# Altium schematic sheet supply_kbd_lcd.SchDoc
size A4
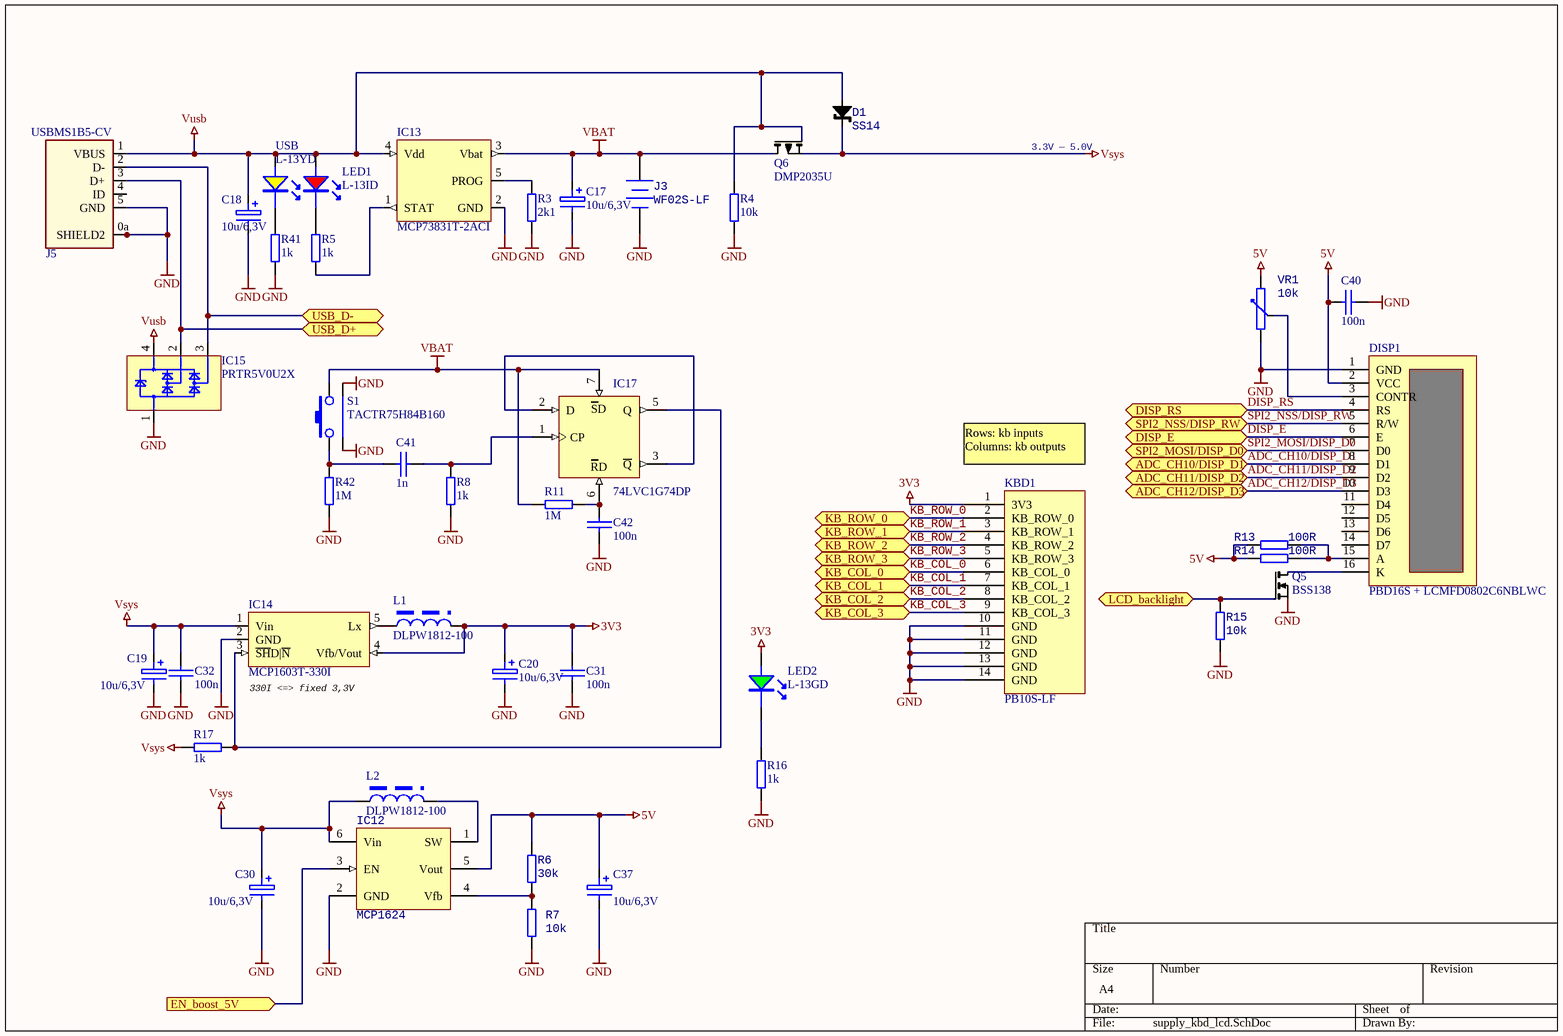
[diagram p0: supply_kbd_lcd.SchDoc]

## Parts
C17  10u/6,3V  [1411_SMDB]
C18  10u/6,3V  [1411_SMDB]
C19  10u/6,3V  [1411_SMDB]
C20  10u/6,3V  [1411_SMDB]
C30  10u/6,3V  [1411_SMDB]
C31  100n  [0603C]
C32  100n  [0603C]
C37  10u/6,3V  [1411_SMDB]
C40  100n  [0603C]
C41  1n  [0603C]
C42  100n  [0603C]
D1  SS14  [DO-214AC/SMA]
DISP1  PBD16S + LCMFD0802C6NBLWC  [IDC16]
IC12  MCP1624  [SOT23-6]
IC13  MCP73831T-2ACI  [SOT23-5]
IC14  MCP1603T-330I  [SOT23-5]
IC15  PRTR5V0U2X  [sot143b]
IC17  74LVC1G74DP  [SOP65P400X110-8N]
J3  WF02S-LF  [CON_WF02S-LF]
J5  USBMS1B5-CV  [USBMS1B5-CV]
KBD1  PB10S-LF  [KBD]
L1  DLPW1812-100  [PW4532]
L2  DLPW1812-100  [PW4532]
LED1  L-13ID  [LED_L-13ID]
LED2  L-13GD  [LED_L-13GD]
Q5  BSS138  [SOT-23]
Q6  DMP2035U  [sot-23]
R3  2k1  [0603R]
R4  10k  [0603R]
R5  1k  [0603R]
R6  30k  [0603R]
R7  10k  [0603R]
R8  1k  [0603R]
R11  1M  [0603R]
R13  100R  [0603R]
R14  100R  [0603R]
R15  10k  [0603R]
R16  1k  [0603R]
R17  1k  [0603R]
R41  1k  [0603R]
R42  1M  [0603R]
S1  TACTR75H84B160  [PB_ALPS_SKHHLQA010]
USB  L-13YD  [LED_L-13YD]
VR1  10k  [POT_RM6v]

## Ports
ADC_CH10/DISP_D1, ADC_CH11/DISP_D2, ADC_CH12/DISP_D3, DISP_E, DISP_RS, EN_boost_5V (in), KB_COL_0, KB_COL_1, KB_COL_2, KB_COL_3, KB_ROW_0, KB_ROW_1, KB_ROW_2, KB_ROW_3, LCD_backlight, SPI2_MOSI/DISP_D0, SPI2_NSS/DISP_RW, USB_D+, USB_D-

## Nets
3V3: C20.1 C31.1 IC14.4(Vfb/Vout) KBD1.1(3V3) L1.2 LED2.A
5V: C37.1 C40.1 DISP1.2(VCC) IC12.5(Vout) R6.2 R13.2 R14.2 VR1.3(U)
GND: C17.2 C18.2 C19.2 C20.2 C30.2 C31.2 C32.2 C37.2 C40.2 C42.1 DISP1.1(GND) IC12.2(GND) IC13.2(GND) IC14.2(GND) IC15.1 IC17.4(GND) J3.2(-) J5.0a(SHIELD2) J5.0b(SHIELD2) J5.0c(SHIELD2) J5.0d(SHIELD2) J5.5(GND) KBD1.10(GND) KBD1.11(GND) KBD1.12(GND) KBD1.13(GND) KBD1.14(GND) Q5.2(S) R3.1 R4.1 R7.1 R8.1 R15.1 R16.2 R41.2 R42.2 S1.3 S1.4 VR1.1(D)
VBAT: C17.1 IC13.3(Vbat) IC17.7(~{S}D) IC17.8(VCC) J3.1(+) Q6.3(D) R11.1 S1.2
Vsys: C19.1 C30.1 C32.1 D1.K IC12.6(Vin) IC14.1(Vin) L2.1 Q6.2(S) R17.2
Vusb: C18.1 D1.A IC13.4(Vdd) IC15.4 J5.1(VBUS) LED1.A Q6.1(G) R4.2 USB.A
ADC_CH10/DISP_D1: DISP1.8(D1) ; port ADC_CH10/DISP_D1
ADC_CH11/DISP_D2: DISP1.9(D2) ; port ADC_CH11/DISP_D2
ADC_CH12/DISP_D3: DISP1.10(D3) ; port ADC_CH12/DISP_D3
DISP_E: DISP1.6(E) ; port DISP_E
DISP_RS: DISP1.4(RS) ; port DISP_RS
EN_boost_5V: IC12.3(EN) ; port EN_boost_5V
KB_COL_0: KBD1.6(KB_COL_0) ; port KB_COL_0
KB_COL_1: KBD1.7(KB_COL_1) ; port KB_COL_1
KB_COL_2: KBD1.8(KB_COL_2) ; port KB_COL_2
KB_COL_3: KBD1.9(KB_COL_3) ; port KB_COL_3
KB_ROW_0: KBD1.2(KB_ROW_0) ; port KB_ROW_0
KB_ROW_1: KBD1.3(KB_ROW_1) ; port KB_ROW_1
KB_ROW_2: KBD1.4(KB_ROW_2) ; port KB_ROW_2
KB_ROW_3: KBD1.5(KB_ROW_3) ; port KB_ROW_3
LCD_backlight: Q5.1(G) R15.2 ; port LCD_backlight
SPI2_MOSI/DISP_D0: DISP1.7(D0) ; port SPI2_MOSI/DISP_D0
SPI2_NSS/DISP_RW: DISP1.5(R/W) ; port SPI2_NSS/DISP_RW
USB_D+: IC15.2 J5.3(D+) ; port USB_D+
USB_D-: IC15.3 J5.2(D-) ; port USB_D-
NetC41_1: C41.1 R42.1 S1.1
NetC41_2: C41.2 IC17.1(CP) R8.2
NetC42_2: C42.2 IC17.6(~{RD}) R11.2
NetDISP1_3: DISP1.3(CONTR) VR1.2(W)
NetDISP1_15: DISP1.15(A) R13.1 R14.1
NetDISP1_16: DISP1.16(K) Q5.3(D)
NetIC12_1: IC12.1(SW) L2.2
NetIC12_4: IC12.4(Vfb) R6.1 R7.2
NetIC13_1: IC13.1(STAT) R5.2
NetIC13_5: IC13.5(PROG) R3.2
NetIC14_3: IC14.3(~{SH}D|~{N}) IC17.5(Q) R17.1
NetIC14_5: IC14.5(Lx) L1.1
NetIC17_2: IC17.2(D) IC17.3(~{Q})
NetLED1_K: LED1.K R5.1
NetLED2_K: LED2.K R16.1
NetR41_1: R41.1 USB.K

Not connected (* = marked no-connect by the designer): DISP1 11(D4) 12(D5) 13(D6) 14(D7); J5 4(ID)

## Notes on the sheet
- 3.3V — 5.0V
- (near KBD1) Rows: kb inputs
  Columns: kb outputs
- (near IC14) 330I <=> fixed 3,3V
- (in symbol 74LVC1G74DP) SD; RD

## Library data of the parts
C17-C20 C30 C37 = CAP_TANTALIUM: Tantalium Capacitor
C31 C32 C40-C42 = CAP_general: Capacitor
D1 = D_LS101A: Schottky, 60V, 1A; Farnell: 1456528
DISP1 = LCD_HD44780_LED: LCD character display socket with backlight
IC12 = DC/DC_MCP1640: Adjustable 5V/350mA Step-up DC/DC converter (TME)
IC13 = REG_MCP73831: Single-Cell, Fully Integrated Li-Ion charger
IC14 = PWM_MCP1603T: 3.3V. 500mA buck regulator
IC15 = D_TVS_PRTR5V0U2X: dual 5.5 ESD transient voltage suppressor
IC17 = 74LVC1G74DP: Single D-type flip-flop with set and reset, positive edge trigger; Manufacturer: NXP SEMICONDUCTORS; Table: Standard Logic; Part Number: 74LVC1G74DP; Component Kind: Standard; Component Type: Standard; Device: 74LVC1G74DP; PackageDescription: SOP, 0.65mm, pitch; 8 pin, 3.00mm W X 3.00mm L X 1.10mm H body, PC Medium Density; Part Description: Single D-Type Flip-Flop With Set And Reset, Positive Edge Trigger; Manufacturer Part Number: 74LVC1G74DP; Pin Count: 8; Case: TSSOP8; Mounted: Yes; Socket: No; SMD: Yes; ComponentHeight: 1.1mm; Author: CERN DEM JLC; HelpURL: \\cern.ch\dfs\Applications\Altium\Datasheets\74LVC1G74DP.pdf; CreateDate: 2010-04-26; LatestRevisionDate: 2010-04-26
J3 = Battery: Multicell Battery; Published: 24-Mar-1999; LatestRevisionDate: 17-Jul-2002; LatestRevisionNote: Re-released for DXP Platform.; PackageReference: BAT-2; Publisher: Altium Limited; PackageDescription: Battery; 2 Leads
J5 = CON_USB_B_MINI: USB mini B connector (Maritex); Part Number: 10133; Device: USB_Mini_AB
KBD1 = KBD_4x4_10pin: pin to pad: 11>10a 12>10b 13>10c 14>10d
L1 L2 = L_POWER_PW4532: SMT power inductor , Maritex,
LED1 = LED_THT_2mm_R: LED (TME)
LED2 = LED_THT_2mm_G: LED (TME)
Q5 = Q_BSS138
Q6 = Q_BSS84: P MOSFET 50V, 0.36W, 0.15A
R3-R8 R11 R13-R17 R41 R42 = RES_0603: SMD Resistor
S1 = SW-PB_RA_5.8mm: Push button
USB = LED_THT_2mm_Y: LED (TME)
VR1 = TRIMPOT_RM6_HOR: Carbon trimpot, 0.1W, +/- 30%; Farnell: 1227558